# EAGLE schematic COTS (EAGLE 9.6.2)
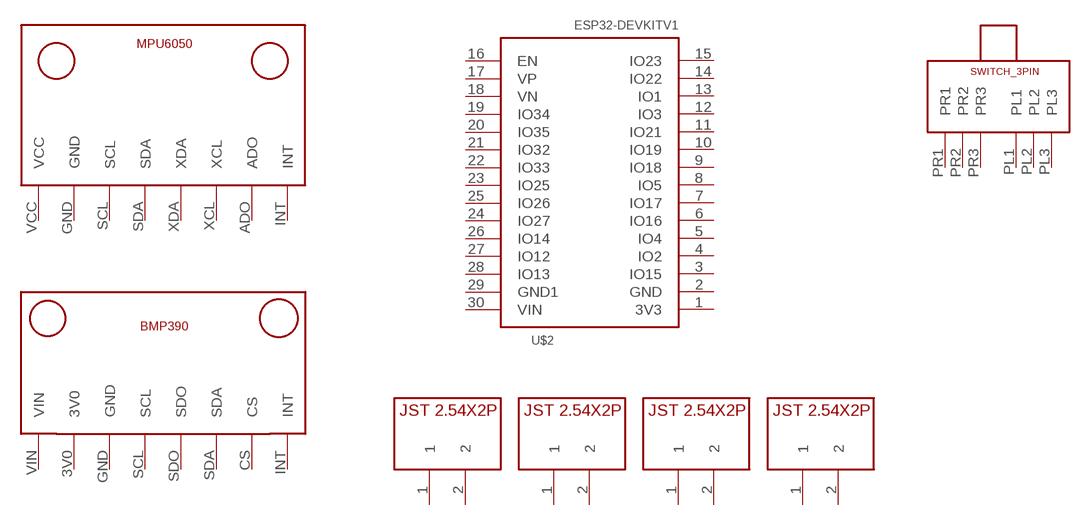
[diagram p0: schematic, sheet 1]

## Parts
U$1  MPU6050V1  [MPU6050_FOOTPRINT]
U$2  ESP32DEVKITV1  [ESP32-DEVKITV1]
U$3  BMP390V1  [BMP390_FOOTPRINT]
U$4  JST2.54X2P  [JST2.54X2P_FOOTPRINT]
U$5  JST2.54X2P  [JST2.54X2P_FOOTPRINT]
U$6  JST2.54X2P  [JST2.54X2P_FOOTPRINT]
U$7  JST2.54X2P  [JST2.54X2P_FOOTPRINT]
U$8  SWITCH_3PIN  [SWITCH_3PIN_FOOTPRINT]
Unconnected: U$1.ADO U$1.GND U$1.INT U$1.SCL U$1.SDA U$1.VCC U$1.XCL U$1.XDA U$2.1(3V3) U$2.2(GND) U$2.3(IO15) U$2.4(IO2) U$2.5(IO4) U$2.6(IO16) U$2.7(IO17) U$2.8(IO5) U$2.9(IO18) U$2.10(IO19) U$2.11(IO21) U$2.12(IO3) U$2.13(IO1) U$2.14(IO22) U$2.15(IO23) U$2.16(EN) U$2.17(VP) U$2.18(VN) U$2.19(IO34) U$2.20(IO35) U$2.21(IO32) U$2.22(IO33) U$2.23(IO25) U$2.24(IO27) U$2.25(IO26) U$2.26(IO14) U$2.27(IO12) U$2.28(IO13) U$2.29(GND1) U$2.30(VIN) U$3.3V0 U$3.CS U$3.GND U$3.INT U$3.SCL U$3.SDA U$3.SDO U$3.VIN U$4.1 U$4.2 U$5.1 U$5.2 U$6.1 U$6.2 U$7.1 U$7.2 U$8.PL1 U$8.PL2 U$8.PL3 U$8.PR1 U$8.PR2 U$8.PR3

## Library data of the parts
U$1 = CRD:MPU6050: Acelerômetro e Giroscópio
U$2 = ESP32-DEVKITV1:ESP32DEVKITV1
U$3 = CRD:BMP390: Sensor barométrico
U$4-U$7 = CRD:JST2.54X2P: Conector JST 2 pinos (2.54mm de distância entre pinos)
U$8 = CRD:SWITCH_3PIN